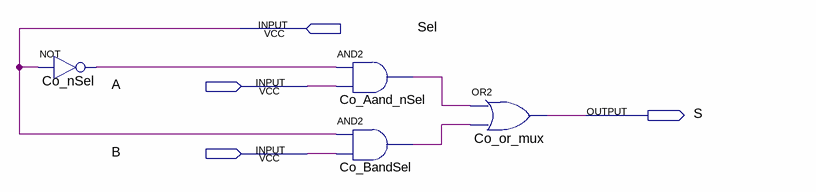
[diagram p0: schematic sheet]
// Quartus schematic mux2x1.bdf as structural Verilog: 4 symbols, 4 pins
module mux2x1 (
  input  Sel,
  input  A,
  input  B,
  output S
);

  wire Co_Aand_nSel_out, Co_BandSel_out, Co_nSel_out;

  not Co_nSel (Co_nSel_out, Sel);
  and Co_Aand_nSel (Co_Aand_nSel_out, Co_nSel_out, A);
  and Co_BandSel (Co_BandSel_out, Sel, B);
  or Co_or_mux (S, Co_Aand_nSel_out, Co_BandSel_out);
endmodule
